# Altium schematic sheet [1]_FPGA.SchDoc: FPGA
size A3; Author: Eladio Delgado; CompanyName: bq - Mundo Reader; Organization: bq - Mundo Reader; Revision: 0; SheetNumber: 1; SheetTotal: 5
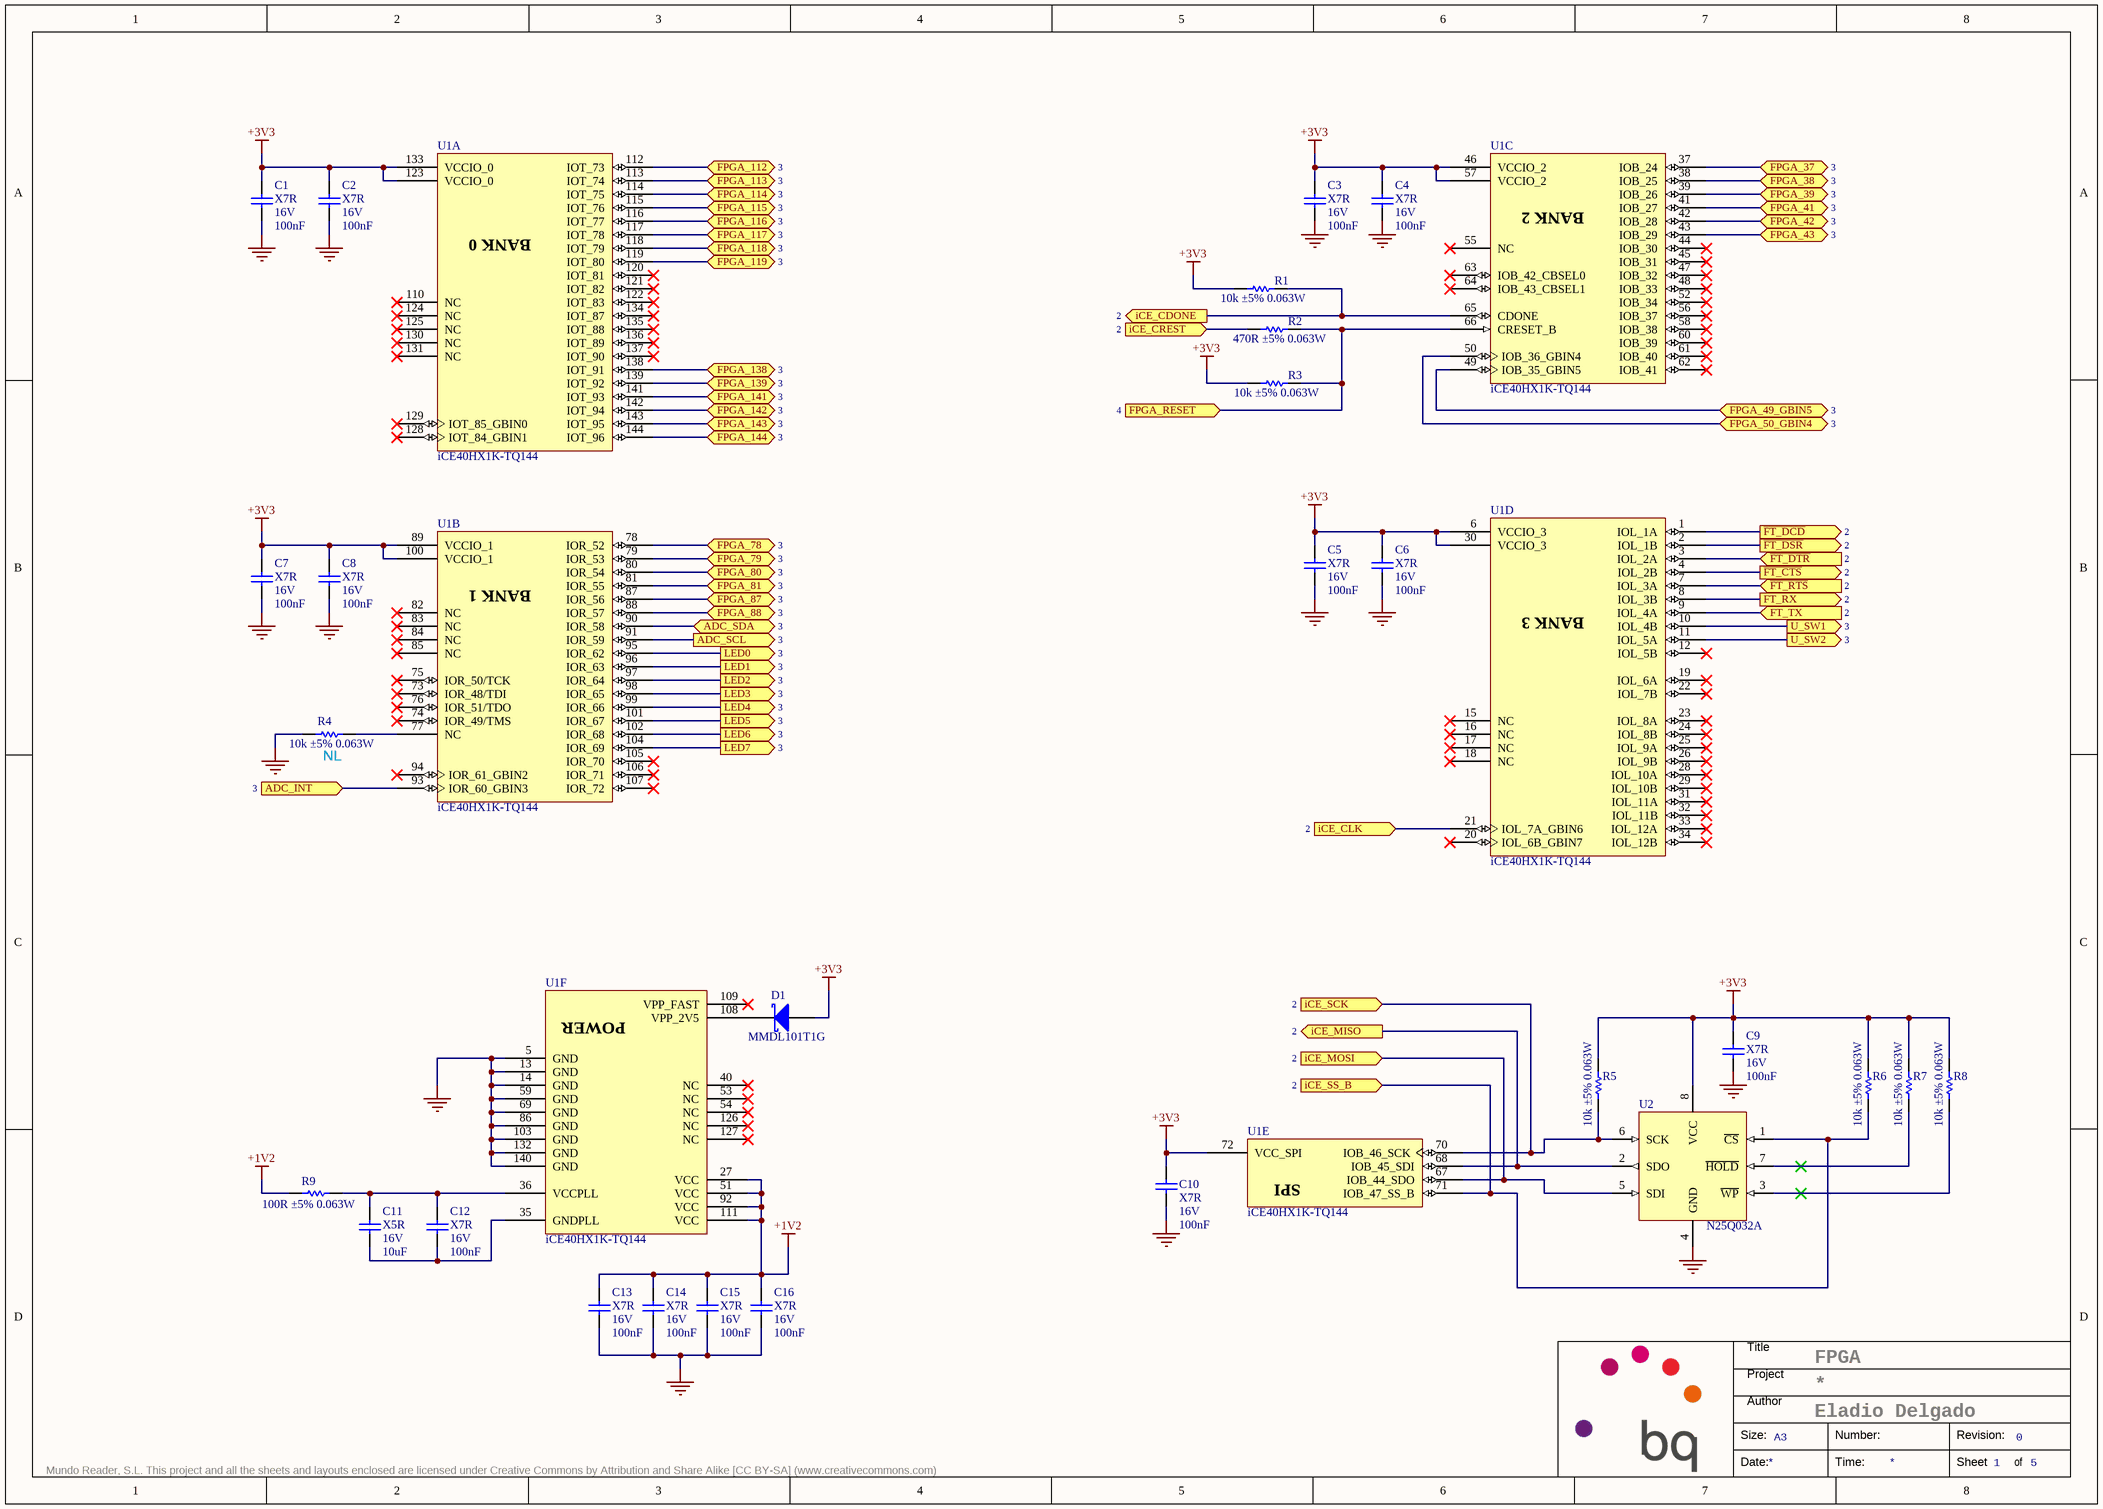
[diagram p0: [1]_FPGA.SchDoc]

## Parts
C1  Dielectric: X7R  Voltage: 16V  Capacitance: 100nF  [C0402]  (hidden comment: Capacitor)
C2  Dielectric: X7R  Voltage: 16V  Capacitance: 100nF  [C0402]  (hidden comment: Capacitor)
C3  Dielectric: X7R  Voltage: 16V  Capacitance: 100nF  [C0402]  (hidden comment: Capacitor)
C4  Dielectric: X7R  Voltage: 16V  Capacitance: 100nF  [C0402]  (hidden comment: Capacitor)
C5  Dielectric: X7R  Voltage: 16V  Capacitance: 100nF  [C0402]  (hidden comment: Capacitor)
C6  Dielectric: X7R  Voltage: 16V  Capacitance: 100nF  [C0402]  (hidden comment: Capacitor)
C7  Dielectric: X7R  Voltage: 16V  Capacitance: 100nF  [C0402]  (hidden comment: Capacitor)
C8  Dielectric: X7R  Voltage: 16V  Capacitance: 100nF  [C0402]  (hidden comment: Capacitor)
C9  Dielectric: X7R  Voltage: 16V  Capacitance: 100nF  [C0402]  (hidden comment: Capacitor)
C10  Dielectric: X7R  Voltage: 16V  Capacitance: 100nF  [C0402]  (hidden comment: Capacitor)
C11  Dielectric: X5R  Voltage: 16V  Capacitance: 10uF  [C0603]  (hidden comment: Capacitor)
C12  Dielectric: X7R  Voltage: 16V  Capacitance: 100nF  [C0402]  (hidden comment: Capacitor)
C13  Dielectric: X7R  Voltage: 16V  Capacitance: 100nF  [C0402]  (hidden comment: Capacitor)
C14  Dielectric: X7R  Voltage: 16V  Capacitance: 100nF  [C0402]  (hidden comment: Capacitor)
C15  Dielectric: X7R  Voltage: 16V  Capacitance: 100nF  [C0402]  (hidden comment: Capacitor)
C16  Dielectric: X7R  Voltage: 16V  Capacitance: 100nF  [C0402]  (hidden comment: Capacitor)
D1  MMDL101T1G  [SOD323]
R1  value 10k ±5% 0.063W  [R0402]  (hidden comment: Resistor)
R2  value 470R ±5% 0.063W  [R0402]  (hidden comment: Resistor)
R3  value 10k ±5% 0.063W  [R0402]  (hidden comment: Resistor)
R4  value 10k ±5% 0.063W  [R0402]  (hidden comment: Resistor)
R5  value 10k ±5% 0.063W  [R0402]  (hidden comment: Resistor)
R6  value 10k ±5% 0.063W  [R0402]  (hidden comment: Resistor)
R7  value 10k ±5% 0.063W  [R0402]  (hidden comment: Resistor)
R8  value 10k ±5% 0.063W  [R0402]  (hidden comment: Resistor)
R9  value 100R ±5% 0.063W  [R0402]  (hidden comment: Resistor)
U1  iCE40HX1K-TQ144  [TQFP-144_IPC-MD]  (parts A,B,C,D,E,F of 6)
U2  N25Q032A  [DFN-8 6x5mm]

## Ports
ADC_INT (in, see 3), ADC_SCL (out, see 3), ADC_SDA (bidir, see 3), FPGA_37 (bidir, see 3), FPGA_38 (bidir, see 3), FPGA_39 (bidir, see 3), FPGA_41 (bidir, see 3), FPGA_42 (bidir, see 3), FPGA_43 (bidir, see 3), FPGA_49_GBIN5 (bidir, see 3), FPGA_50_GBIN4 (bidir, see 3), FPGA_78 (bidir, see 3), FPGA_79 (bidir, see 3), FPGA_80 (bidir, see 3), FPGA_81 (bidir, see 3), FPGA_87 (bidir, see 3), FPGA_88 (bidir, see 3), FPGA_112 (bidir, see 3), FPGA_113 (bidir, see 3), FPGA_114 (bidir, see 3), FPGA_115 (bidir, see 3), FPGA_116 (bidir, see 3), FPGA_117 (bidir, see 3), FPGA_118 (bidir, see 3), FPGA_119 (bidir, see 3), FPGA_138 (bidir, see 3), FPGA_139 (bidir, see 3), FPGA_141 (bidir, see 3), FPGA_142 (bidir, see 3), FPGA_143 (bidir, see 3), FPGA_144 (bidir, see 3), FPGA_RESET (in, see 4), FT_RX (out, see 2), FT_TX (in, see 2), iCE_CDONE (out, see 2), iCE_CLK (in, see 2), iCE_CREST (in, see 2), iCE_MISO (out, see 2), iCE_MOSI (in, see 2), iCE_SCK (in, see 2), iCE_SS_B (in, see 2), LED0 (out, see 3), LED1 (out, see 3), LED2 (out, see 3), LED3 (out, see 3), LED4 (out, see 3), LED5 (out, see 3), LED6 (out, see 3), LED7 (out, see 3), U_SW1 (out, see 3), U_SW2 (out, see 3), ~{FT_CTS} (out, see 2), ~{FT_DCD} (out, see 2), ~{FT_DSR} (out, see 2), ~{FT_DTR} (in, see 2), ~{FT_RTS} (in, see 2)

## Nets
+1V2: C13.2 C14.2 C15.2 C16.2 R9.2 U1.27(VCC) U1.51(VCC) U1.92(VCC) U1.111(VCC)
+3V3: C1.2 C2.2 C3.2 C4.2 C5.2 C6.2 C7.2 C8.2 C9.1 C10.2 D1.A R1.1 R3.1 R5.2 R6.2 R7.2 R8.2 U1.6(VCCIO_3) U1.30(VCCIO_3) U1.46(VCCIO_2) U1.57(VCCIO_2) U1.72(VCC_SPI) U1.89(VCCIO_1) U1.100(VCCIO_1) U1.123(VCCIO_0) U1.133(VCCIO_0) U2.8(VCC)
GND: C1.1 C2.1 C3.1 C4.1 C5.1 C6.1 C7.1 C8.1 C9.2 C10.1 C13.1 C14.1 C15.1 C16.1 R4.1 U1.5(GND) U1.13(GND) U1.14(GND) U1.59(GND) U1.69(GND) U1.86(GND) U1.103(GND) U1.132(GND) U1.140(GND) U2.4(GND)
~{FT_CTS}: U1.4(IOL_2B) ; port ~{FT_CTS}
~{FT_DCD}: U1.1(IOL_1A) ; port ~{FT_DCD}
~{FT_DSR}: U1.2(IOL_1B) ; port ~{FT_DSR}
~{FT_DTR}: U1.3(IOL_2A) ; port ~{FT_DTR}
~{FT_RTS}: U1.7(IOL_3A) ; port ~{FT_RTS}
ADC_INT: U1.93(IOR_60_GBIN3) ; port ADC_INT
ADC_SCL: U1.91(IOR_59) ; port ADC_SCL
ADC_SDA: U1.90(IOR_58) ; port ADC_SDA
FPGA_37: U1.37(IOB_24) ; port FPGA_37
FPGA_38: U1.38(IOB_25) ; port FPGA_38
FPGA_39: U1.39(IOB_26) ; port FPGA_39
FPGA_41: U1.41(IOB_27) ; port FPGA_41
FPGA_42: U1.42(IOB_28) ; port FPGA_42
FPGA_43: U1.43(IOB_29) ; port FPGA_43
FPGA_49_GBIN5: U1.49(IOB_35_GBIN5) ; port FPGA_49_GBIN5
FPGA_50_GBIN4: U1.50(IOB_36_GBIN4) ; port FPGA_50_GBIN4
FPGA_78: U1.78(IOR_52) ; port FPGA_78
FPGA_79: U1.79(IOR_53) ; port FPGA_79
FPGA_80: U1.80(IOR_54) ; port FPGA_80
FPGA_81: U1.81(IOR_55) ; port FPGA_81
FPGA_87: U1.87(IOR_56) ; port FPGA_87
FPGA_88: U1.88(IOR_57) ; port FPGA_88
FPGA_112: U1.112(IOT_73) ; port FPGA_112
FPGA_113: U1.113(IOT_74) ; port FPGA_113
FPGA_114: U1.114(IOT_75) ; port FPGA_114
FPGA_115: U1.115(IOT_76) ; port FPGA_115
FPGA_116: U1.116(IOT_77) ; port FPGA_116
FPGA_117: U1.117(IOT_78) ; port FPGA_117
FPGA_118: U1.118(IOT_79) ; port FPGA_118
FPGA_119: U1.119(IOT_80) ; port FPGA_119
FPGA_138: U1.138(IOT_91) ; port FPGA_138
FPGA_139: U1.139(IOT_92) ; port FPGA_139
FPGA_141: U1.141(IOT_93) ; port FPGA_141
FPGA_142: U1.142(IOT_94) ; port FPGA_142
FPGA_143: U1.143(IOT_95) ; port FPGA_143
FPGA_144: U1.144(IOT_96) ; port FPGA_144
FPGA_RESET: R2.2 R3.2 U1.66(CRESET_B) ; port FPGA_RESET
FT_RX: U1.8(IOL_3B) ; port FT_RX
FT_TX: U1.9(IOL_4A) ; port FT_TX
iCE_CDONE: R1.2 U1.65(CDONE) ; port iCE_CDONE
iCE_CLK: U1.21(IOL_7A_GBIN6) ; port iCE_CLK
iCE_CREST: R2.1 ; port iCE_CREST
iCE_MISO: U1.68(IOB_45_SDI) U2.2(SDO) ; port iCE_MISO
iCE_MOSI: U1.67(IOB_44_SDO) U2.5(SDI) ; port iCE_MOSI
iCE_SCK: R5.1 U1.70(IOB_46_SCK) U2.6(SCK) ; port iCE_SCK
iCE_SS_B: R6.1 U1.71(IOB_47_SS_B) U2.1(~{CS}) ; port iCE_SS_B
LED0: U1.95(IOR_62) ; port LED0
LED1: U1.96(IOR_63) ; port LED1
LED2: U1.97(IOR_64) ; port LED2
LED3: U1.98(IOR_65) ; port LED3
LED4: U1.99(IOR_66) ; port LED4
LED5: U1.101(IOR_67) ; port LED5
LED6: U1.102(IOR_68) ; port LED6
LED7: U1.104(IOR_69) ; port LED7
U_SW1: U1.10(IOL_4B) ; port U_SW1
U_SW2: U1.11(IOL_5A) ; port U_SW2
NetC11_1: C11.1 C12.1 U1.35(GNDPLL)
NetC11_2: C11.2 C12.2 R9.1 U1.36(VCCPLL)
NetD1_k: D1.k(K) U1.108(VPP_2V5)
NetR4_2: R4.2 U1.77(NC)
NetR7_1: R7.1 U2.7(~{HOLD})
NetR8_1: R8.1 U2.3(~{WP})

Not connected (* = marked no-connect by the designer): U1 12(IOL_5B)* 15(NC)* 16(NC)* 17(NC)* 18(NC)* 19(IOL_6A)* 20(IOL_6B_GBIN7)* 22(IOL_7B)* 23(IOL_8A)* 24(IOL_8B)* 25(IOL_9A)* 26(IOL_9B)* 28(IOL_10A)* 29(IOL_10B)* 31(IOL_11A)* 32(IOL_11B)* 33(IOL_12A)* 34(IOL_12B)* 40(NC)* 44(IOB_30)* 45(IOB_31)* 47(IOB_32)* 48(IOB_33)* 52(IOB_34)* 53(NC)* 54(NC)* 55(NC)* 56(IOB_37)* 58(IOB_38)* 60(IOB_39)* 61(IOB_40)* 62(IOB_41)* 63(IOB_42_CBSEL0)* 64(IOB_43_CBSEL1)* 73(IOR_48/TDI)* 74(IOR_49/TMS)* 75(IOR_50/TCK)* 76(IOR_51/TDO)* 82(NC)* 83(NC)* 84(NC)* 85(NC)* 94(IOR_61_GBIN2)* 105(IOR_70)* 106(IOR_71)* 107(IOR_72)* 109(VPP_FAST)* 110(NC)* 120(IOT_81)* 121(IOT_82)* 122(IOT_83)* 124(NC)* 125(NC)* 126(NC)* 127(NC)* 128(IOT_84_GBIN1)* 129(IOT_85_GBIN0)* 130(NC)* 131(NC)* 134(IOT_87)* 135(IOT_88)* 136(IOT_89)* 137(IOT_90)*

## Notes on the sheet
- (near R4) NL
- Title
- Project
- Size:
- Author
- A3
- Number:
- Revision:
- Mundo Reader, S.L. This project and all the sheets and layouts enclosed are licensed under Creative Commons by Attribution and Share Alike [CC BY-SA] (www.creativecommons.com)
- Date:
- Time:
- Sheet
- of
- (in symbol iCE40-HX1K, part A) BANK 0
- (in symbol iCE40-HX1K, part B) BANK 1
- (in symbol iCE40-HX1K, part C) BANK 2
- (in symbol iCE40-HX1K, part D) BANK 3
- (in symbol iCE40-HX1K, part E) SPI
- (in symbol iCE40-HX1K, part F) POWER

## Library data of the parts
C1-C10 C12-C16 = C0402_100nF_16V_±10%: Capacitor SMD; Manufacturer: Kemet; Value: 100nF ±10% 16V; Tolerance: ±10%; OrderingCode: C0402C104K4RAC; Temp_ Max: 125; Temp_ Min: -55; Part Number: C0402_100nF_16V_±10%; Price (€): 0,05
C11 = C0603_10uF_16V_±20%: Capacitor SMD; Manufacturer: Taiyo Yuden; Value: 10uF ±20% 16V; Tolerance: ±20%; OrderingCode: EMK107BBJ106MA-T; Temp_ Max: 85; Temp_ Min: -55; OrderingCode 2: C1608X5R1C106M080AB; Part Number: C0603_10uF_16V_±20%; Price (€): 0,124; Manufacturer 2: TDK
D1 = MMDL101T1G: Schottky Diode; Manufacturer: On Semiconductor; Ifor: 100mA; Vrrm: 7V; Ifsm: 200mA; Vf: 0,5V; Temp_ Max: 150; Temp_ Min: -55; Value: 100mA 7V; Part Number: MMDL101T1G; OrderingCode: MMDL101T1G; Price (€): 0,046
R1 R3-R8 = R0402_10k_0.063W_±5%: Resistor, SMD; Manufacturer: Vishay; Tolerance: ±5%; OrderingCode: CRCW040210K0JN; Power: 0.063W; Resistance: 10k; Temp_ Max: 155; Temp_ Min: -55; PackageDescription: SMD; Part Number: R0402_10k_0.063W_±5%; Price (€): 0,003
R2 = R0402_470R_0.063W_±5%: Resistor, SMD; Manufacturer: Vishay; Tolerance: ±5%; OrderingCode: CRCW0402470RJN; Power: 0.063W; Resistance: 470R; Temp_ Max: 155; Temp_ Min: -55; PackageDescription: SMD; Part Number: R0402_470R_0.063W_±5%; Price (€): 0,003
R9 = R0402_100R_0.063W_±5%: Resistor, SMD; Manufacturer: Vishay; Tolerance: ±5%; OrderingCode: CRCW0402100RJN; Power: 0.063W; Resistance: 100R; Temp_ Max: 155; Temp_ Min: -55; PackageDescription: SMD; Part Number: R0402_100R_0.063W_±5%; Price (€): 0,003
U1 = iCE40-HX1K: iCE40 HX1K Series FPGA Family, 1280 Logic Cells, 1.2 V Core, 64 K Embedded RAM Bits, 144-pin TQFP, Pb-Free, Tray; Manufacturer: Lattice; Temp_ Max: 85; Temp_ Min: -40; Part Number: iCE40-HX1K; OrderingCode: iCE40HX1K-TQ144; Price (€): 4
U2 = N25Q032A: NOR Flash Memory, serial; Manufacturer: Micron; OrderingCode: N25Q032A13EF640E; Temp_ Max: 85; Temp_ Min: -40; OrderingCode 2: S25FL032P0XNFI011; Value: 32Mb; Part Number: N25Q032A; Supplier: Silica; Price (€): 0,9; Manufacturer 2: Spansion